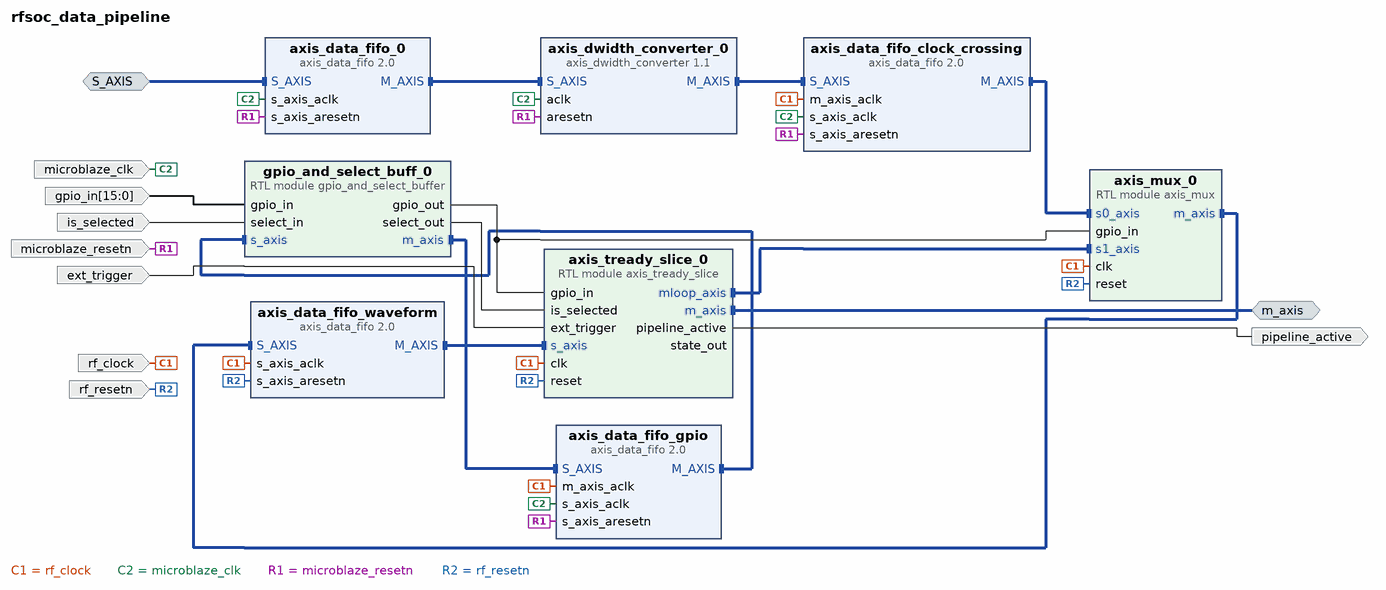
[diagram p0: block diagram of the top level]
# Vivado block design rfsoc_data_pipeline, xczu29dr-ffvf1760-2-e, Vivado 2019.1
create_bd_design rfsoc_data_pipeline

create_bd_intf_port -mode Master -vlnv xilinx.com:interface:axis_rtl:1.0 m_axis
set_property -dict {CONFIG.FREQ_HZ 250000000} [get_bd_intf_ports m_axis]
create_bd_intf_port -mode Slave -vlnv xilinx.com:interface:axis_rtl:1.0 S_AXIS
set_property -dict [list \
  CONFIG.HAS_TKEEP 0 \
  CONFIG.HAS_TLAST 0 \
  CONFIG.HAS_TREADY 1 \
  CONFIG.HAS_TSTRB 0 \
  CONFIG.LAYERED_METADATA undef \
  CONFIG.TDATA_NUM_BYTES 4 \
  CONFIG.TDEST_WIDTH 0 \
  CONFIG.TID_WIDTH 0 \
  CONFIG.TUSER_WIDTH 0 \
] [get_bd_intf_ports S_AXIS]
create_bd_port -dir I -type clk microblaze_clk
set_property -dict [list \
  CONFIG.ASSOCIATED_BUSIF S_AXIS \
  CONFIG.ASSOCIATED_RESET microblaze_resetn \
  CONFIG.FREQ_HZ 100000000 \
] [get_bd_ports microblaze_clk]
create_bd_port -dir I -type clk rf_clock
set_property -dict [list \
  CONFIG.ASSOCIATED_BUSIF m_axis \
  CONFIG.ASSOCIATED_RESET rf_resetn \
  CONFIG.FREQ_HZ 250000000 \
] [get_bd_ports rf_clock]
create_bd_port -dir I -type rst microblaze_resetn
create_bd_port -dir I -type rst rf_resetn
create_bd_port -dir I ext_trigger
create_bd_port -dir O pipeline_active
create_bd_port -dir I is_selected
create_bd_port -dir I -from 15 -to 0 gpio_in

create_bd_cell -type ip -vlnv xilinx.com:ip:axis_data_fifo:2.0 axis_data_fifo_0
set_property -dict {CONFIG.FIFO_DEPTH 16 CONFIG.TDATA_NUM_BYTES 4} [get_bd_cells axis_data_fifo_0]
create_bd_cell -type ip -vlnv xilinx.com:ip:axis_dwidth_converter:1.1 axis_dwidth_converter_0
set_property -dict {CONFIG.M_TDATA_NUM_BYTES 32 CONFIG.S_TDATA_NUM_BYTES 4} [get_bd_cells axis_dwidth_converter_0]
create_bd_cell -type ip -vlnv xilinx.com:ip:axis_data_fifo:2.0 axis_data_fifo_clock_crossing
set_property -dict [list \
  CONFIG.FIFO_DEPTH 16 \
  CONFIG.IS_ACLK_ASYNC 1 \
  CONFIG.TDATA_NUM_BYTES 32 \
] [get_bd_cells axis_data_fifo_clock_crossing]
create_bd_cell -type ip -vlnv xilinx.com:ip:axis_data_fifo:2.0 axis_data_fifo_waveform
set_property -dict {CONFIG.FIFO_DEPTH 4096 CONFIG.TDATA_NUM_BYTES 32} [get_bd_cells axis_data_fifo_waveform]
create_bd_cell -type ip -vlnv xilinx.com:ip:axis_data_fifo:2.0 axis_data_fifo_gpio
set_property -dict {CONFIG.FIFO_DEPTH 16 CONFIG.IS_ACLK_ASYNC 1 CONFIG.TDATA_NUM_BYTES 4} [get_bd_cells axis_data_fifo_gpio]
create_bd_cell -type module -reference axis_mux axis_mux_0
create_bd_cell -type module -reference axis_tready_slice axis_tready_slice_0
create_bd_cell -type module -reference gpio_and_select_buffer gpio_and_select_buff_0

# ---- connections ----

connect_bd_intf_net -intf_net S_AXIS_0_1 [get_bd_intf_ports S_AXIS] [get_bd_intf_pins axis_data_fifo_0/S_AXIS]
connect_bd_intf_net [get_bd_intf_pins axis_data_fifo_clock_crossing/S_AXIS] [get_bd_intf_pins axis_dwidth_converter_0/M_AXIS]
connect_bd_intf_net -intf_net axis_data_fifo_1_M_AXIS [get_bd_intf_pins axis_mux_0/s0_axis] [get_bd_intf_pins axis_data_fifo_clock_crossing/M_AXIS]
connect_bd_intf_net [get_bd_intf_pins axis_dwidth_converter_0/S_AXIS] [get_bd_intf_pins axis_data_fifo_0/M_AXIS]
connect_bd_intf_net -intf_net axis_data_fifo_2_M_AXIS [get_bd_intf_pins axis_data_fifo_waveform/M_AXIS] [get_bd_intf_pins axis_tready_slice_0/s_axis]
connect_bd_intf_net [get_bd_intf_pins axis_mux_0/m_axis] [get_bd_intf_pins axis_data_fifo_waveform/S_AXIS]
connect_bd_intf_net [get_bd_intf_ports m_axis] [get_bd_intf_pins axis_tready_slice_0/m_axis]
connect_bd_intf_net [get_bd_intf_pins axis_data_fifo_gpio/M_AXIS] [get_bd_intf_pins gpio_and_select_buff_0/s_axis]
connect_bd_intf_net [get_bd_intf_pins axis_data_fifo_gpio/S_AXIS] [get_bd_intf_pins gpio_and_select_buff_0/m_axis]
connect_bd_intf_net [get_bd_intf_pins axis_tready_slice_0/mloop_axis] [get_bd_intf_pins axis_mux_0/s1_axis]
connect_bd_net [get_bd_ports rf_clock] \
  [get_bd_pins axis_data_fifo_gpio/m_axis_aclk] [get_bd_pins axis_data_fifo_waveform/s_axis_aclk] \
  [get_bd_pins axis_data_fifo_clock_crossing/m_axis_aclk] [get_bd_pins axis_mux_0/clk] [get_bd_pins axis_tready_slice_0/clk]
connect_bd_net [get_bd_ports microblaze_clk] \
  [get_bd_pins axis_data_fifo_gpio/s_axis_aclk] [get_bd_pins axis_data_fifo_clock_crossing/s_axis_aclk] \
  [get_bd_pins axis_dwidth_converter_0/aclk] [get_bd_pins axis_data_fifo_0/s_axis_aclk]
connect_bd_net -net microblaze_reset_1 [get_bd_ports microblaze_resetn] \
  [get_bd_pins axis_data_fifo_gpio/s_axis_aresetn] [get_bd_pins axis_data_fifo_clock_crossing/s_axis_aresetn] \
  [get_bd_pins axis_dwidth_converter_0/aresetn] [get_bd_pins axis_data_fifo_0/s_axis_aresetn]
connect_bd_net -net rf_reset_1 [get_bd_ports rf_resetn] \
  [get_bd_pins axis_data_fifo_waveform/s_axis_aresetn] [get_bd_pins axis_mux_0/reset] [get_bd_pins axis_tready_slice_0/reset]
connect_bd_net [get_bd_ports gpio_in] [get_bd_pins gpio_and_select_buff_0/gpio_in]
connect_bd_net [get_bd_pins gpio_and_select_buff_0/gpio_out] [get_bd_pins axis_mux_0/gpio_in] [get_bd_pins axis_tready_slice_0/gpio_in]
# net state_out has one end: axis_tready_slice_0/state_out
connect_bd_net [get_bd_ports is_selected] [get_bd_pins gpio_and_select_buff_0/select_in]
connect_bd_net [get_bd_pins gpio_and_select_buff_0/select_out] [get_bd_pins axis_tready_slice_0/is_selected]
connect_bd_net [get_bd_ports ext_trigger] [get_bd_pins axis_tready_slice_0/ext_trigger]
connect_bd_net [get_bd_pins axis_tready_slice_0/pipeline_active] [get_bd_ports pipeline_active]

validate_bd_design
save_bd_design
